# Altium schematic sheet 3_Connectors.SchDoc
size A4; SheetNumber: 3; SheetTotal: 3
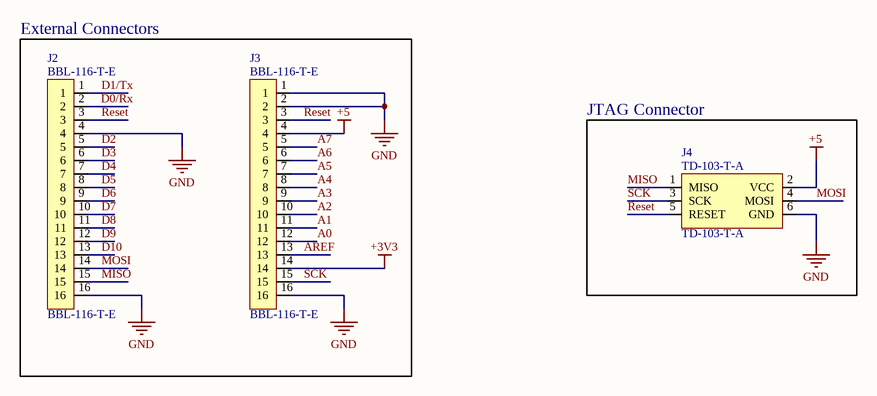
[diagram p0: 3_Connectors.SchDoc]

## Parts
J2  BBL-116-T-E  [BBL-116-T-E]
J3  BBL-116-T-E  [BBL-116-T-E]
J4  TD-103-T-A  [TD-103-T-A]

## Blocks framed on the sheet
External Connectors: J2 J3
JTAG Connector: J4

## Nets
+3V3: J3.14
+5: J3.4 J4.2(VCC)
GND: J2.4 J2.16 J3.1 J3.2 J3.16 J4.6(GND)
A0: J3.12
A1: J3.11
A2: J3.10
A3: J3.9
A4: J3.8
A5: J3.7
A6: J3.6
A7: J3.5
AREF: J3.13
D0/Rx: J2.2
D1/Tx: J2.1
D2: J2.5
D3: J2.6
D4: J2.7
D5: J2.8
D6: J2.9
D7: J2.10
D8: J2.11
D9: J2.12
D10: J2.13
MISO: J2.15 J4.1(MISO)
MOSI: J2.14 J4.4(MOSI)
Reset: J2.3 J3.3 J4.5(RESET)
SCK: J3.15 J4.3(SCK)

## Library data of the parts
J2 J3 = BBL-116-T-E: 16 POS Header, Through Hole
J4 = TD-103-T-A: AVRISP MK2